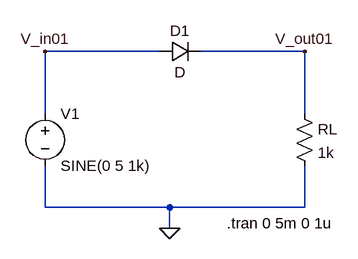
[diagram p0: schematic p01HalfWaveRectifier.asc]
p01HalfWaveRectifier.asc, the LTspice schematic file:
Version 4
SHEET 1 880 680
WIRE 112 96 -64 96
WIRE 336 96 176 96
WIRE -64 192 -64 96
WIRE 336 192 336 96
WIRE -64 336 -64 272
WIRE 128 336 -64 336
WIRE 336 336 336 272
WIRE 336 336 128 336
WIRE 128 368 128 336
FLAG 128 368 0
FLAG -64 96 V_in01
FLAG 336 96 V_out01
SYMBOL diode 112 112 R270
WINDOW 0 32 32 VTop 2
WINDOW 3 0 32 VBottom 2
SYMATTR InstName D1
SYMBOL voltage -64 176 R0
WINDOW 123 0 0 Left 0
WINDOW 39 0 0 Left 0
SYMATTR InstName V1
SYMATTR Value SINE(0 5 1k)
SYMBOL res 320 176 R0
SYMATTR InstName RL
SYMATTR Value 1k
TEXT 216 360 Left 2 !.tran 0 5m 0 1u

The netlist it stands for:
* p01HalfWaveRectifier.asc
D1 V_in01 V_out01 D
V1 V_in01 0 SINE(0 5 1k)
RL V_out01 0 1k
.model D D
.lib standard.dio
.tran 0 5m 0 1u
.backanno
.end

* Results of the author's LTspice run, read from the files saved beside the schematic
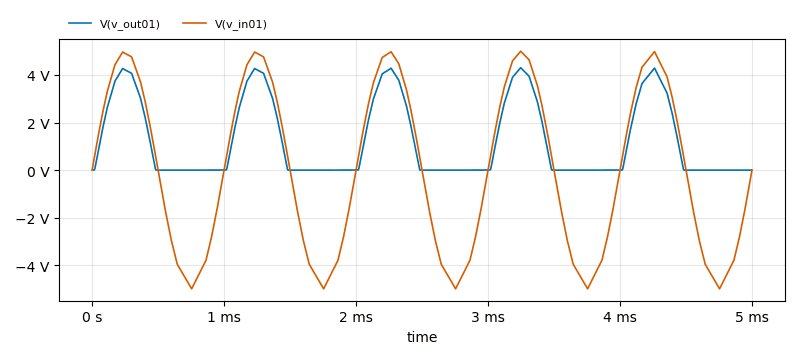
[diagram p1: Transient Analysis of p01HalfWaveRectifier.asc, plotted from the saved traces]
* Transient Analysis, 1 run:
*   V(v_out01): min 0 V, max 4.306 V, average 1.249 V, rms 2.05 V, last 0 V
*   V(v_in01): min -4.992 V, max 4.999 V, average 24.27 mV, rms 3.476 V, last 0 V